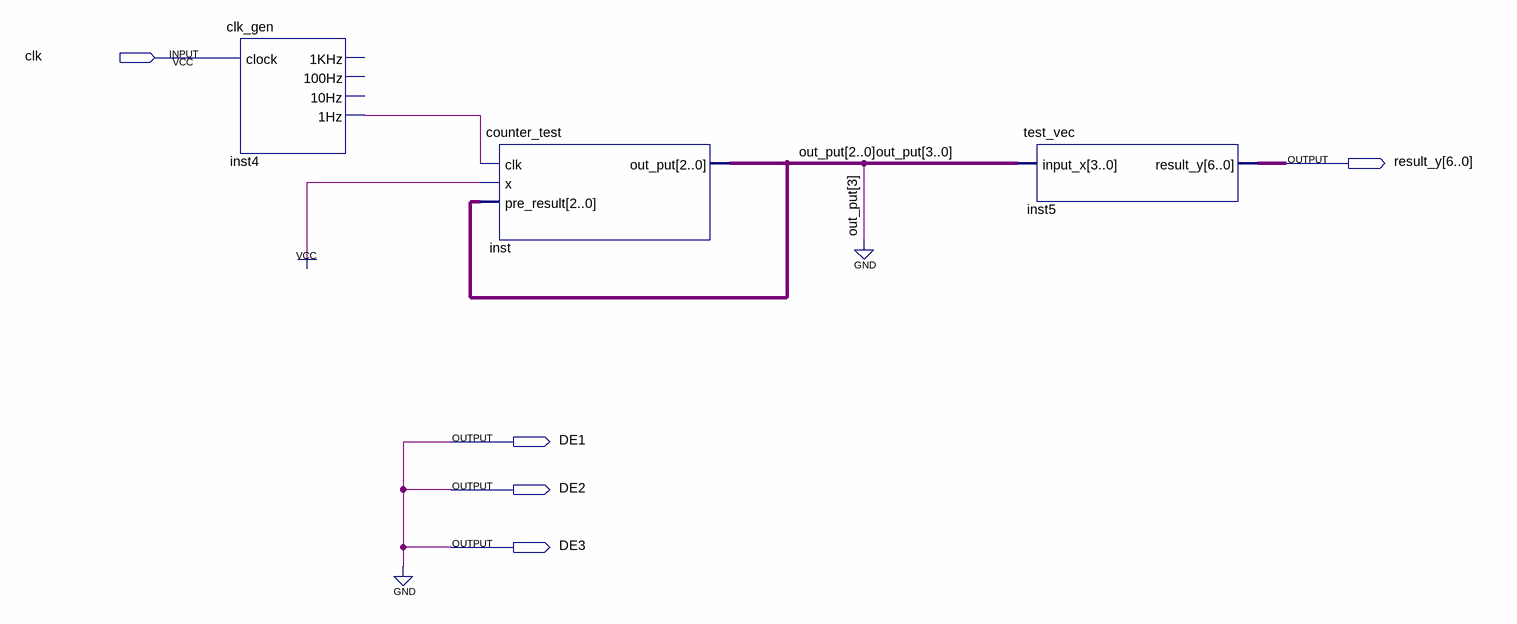
[diagram p0: schematic sheet]
// Quartus schematic test_counter_from_zero_seven.bdf as structural Verilog: 3 symbols, 5 pins
module test_counter_from_zero_seven (
  input  clk,
  output [6:0] result_y,
  output DE1,
  output DE2,
  output DE3
);

  wire inst4_1hz;
  wire [2:0] out_put;

  clk_gen inst4 (.clock(clk), .\1Hz (inst4_1hz));  // open: 1KHz, 100Hz, 10Hz
  counter_test inst (.clk(inst4_1hz), .x(1'b1), .pre_result(out_put), .out_put(out_put));
  test_vec inst5 (.input_x({1'b0, out_put}), .result_y(result_y));

  assign DE1 = 1'b0;
  assign DE2 = 1'b0;
  assign DE3 = 1'b0;
endmodule
